# EAGLE design STorM32 RPiHat v060 (EAGLE 7.5.0)
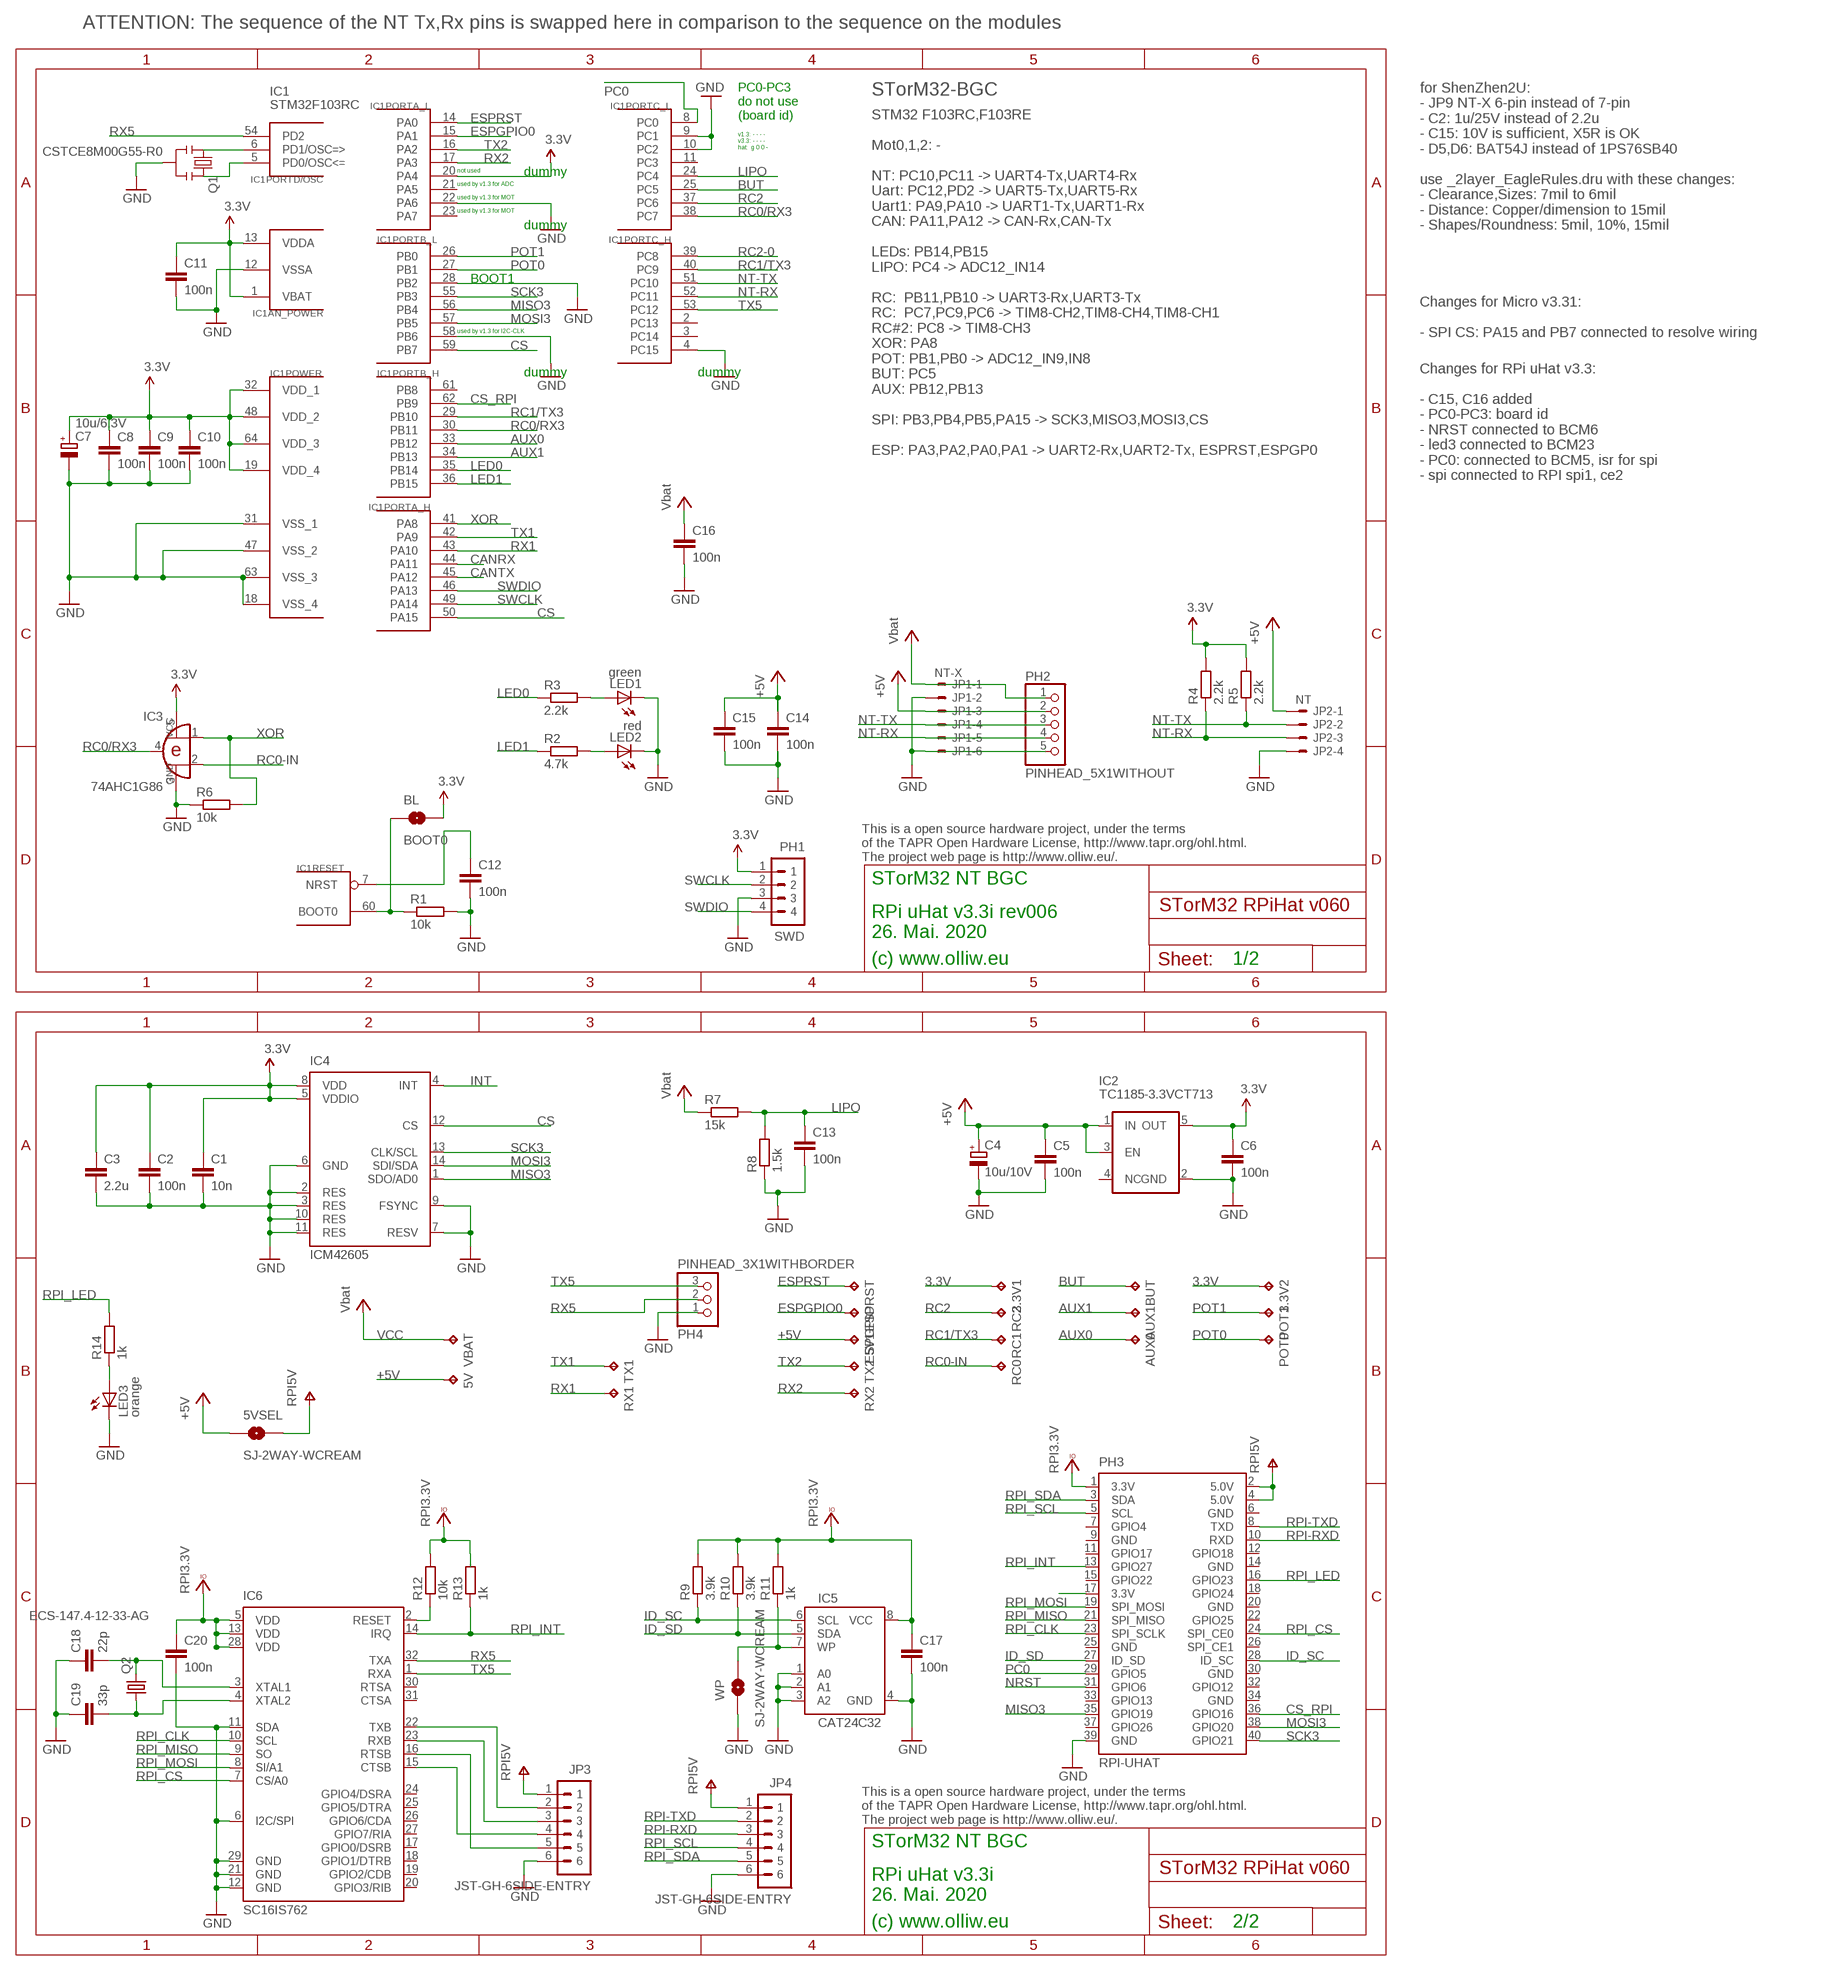
[diagram p0: schematic, sheet 1]

## Parts
3.3V1  TPB1,27  [B1,27]
3.3V2  TPB1,27  [B1,27]
5V  TPB1,27  [B1,27]
5V1  TPB1,27  [B1,27]
5VSEL  SJ-2WAY-WCREAM  [SJ-2WAY-BIG-WCREAM]
AUX0  TPB1,27  [B1,27]
AUX1  TPB1,27  [B1,27]
BL  BOOT0  SOLDERJUMPERNO  [SJ_2S-NO]
BUT  TPB1,27  [B1,27]
C1  10n  C-EUC0402  [C0402]
C2  100n  C-EUC0402  [C0402]
C3  2.2u  C-EUC0603  [C0603]
C4  10u/10V  CPOL-EUSMCA  [SMC_A]
C5  100n  C-EUC0603  [C0603]
C6  100n  C-EUC0402  [C0402]
C7  10u/6.3V  CPOL-EUSMCA  [SMC_A]
C8  100n  C-EUC0402  [C0402]
C9  100n  C-EUC0402  [C0402]
C10  100n  C-EUC0402  [C0402]
C11  100n  C-EUC0402  [C0402]
C12  100n  C-EUC0402  [C0402]
C13  100n  C-EUC0402  [C0402]
C14  100n  C-EUC0402  [C0402]
C15  100n  C-EUC0402  [C0402]
C16  100n  C-EUC0603  [C0603]
C17  100n  C-EUC0402  [C0402]
C18  22p  C-EUC0402  [C0402]
C19  33p  C-EUC0402  [C0402]
C20  100n  C-EUC0402  [C0402]
ESPGPIO  TPB1,27  [B1,27]
ESPRST  TPB1,27  [B1,27]
IC1  STM32F103RCT6  STM32F10XRXT6  [TQFP64]
IC2  TC1185-3.3VCT713  V_REG_TPS76433SOT23-5  [SOT23-5]
IC3  74AHC1G86  [SOT23-5-VER1]
IC4  ICM42605  [LGA14-2.5X3]
IC5  CAT24C32  [TSSOP8-4.3X3]
IC6  SC16IS762  [QFN-32]
JP1  NT-X  SM06B-SRSS-TB  [SM06B-SRSS-TB]
JP2  NT  SM04B-SRSS-TB  [SM04B-SRSS-TB]
JP3  JST-GH-6SIDE-ENTRY  [SM06B-GHS-TB]
JP4  JST-GH-6SIDE-ENTRY  [SM06B-GHS-TB]
LED1  green  LEDCHIPLED_0603  [CHIPLED_0603]
LED2  red  LEDCHIPLED_0603  [CHIPLED_0603]
LED3  orange  LEDCHIPLED_0603  [CHIPLED_0603]
PH1  SWD  P4X1_1P27-OCT_BILEX  [4X1_1P27_OCT_BILEX]
PH2  PINHEAD_5X1WITHOUT  [PINHEAD_5X1_WO]
PH3  RPI-UHAT  [RPI-40W-UHAT]
PH4  PINHEAD_3X1WITHBORDER  [PINHEAD_3X1]
POT0  TPB1,27  [B1,27]
POT1  TPB1,27  [B1,27]
Q1  CSTCE8M00G55-R0  RESONATORSMD  [RESONATOR-SMD]
Q2  ECS-147.4-12-33-AG  QUARZ3.2X2.5  [CRYSTAL-SMD-3P2X2P5]
R1  10k  R-EU_R0402  [R0402]
R2  4.7k  R-EU_R0402  [R0402]
R3  2.2k  R-EU_R0402  [R0402]
R4  2.2k  R-EU_R0402  [R0402]
R5  2.2k  R-EU_R0402  [R0402]
R6  10k  R-EU_R0402  [R0402]
R7  15k  R-EU_R0402  [R0402]
R8  1.5k  R-EU_R0402  [R0402]
R9  3.9k  R-EU_R0402  [R0402]
R10  3.9k  R-EU_R0402  [R0402]
R11  1k  R-EU_R0402  [R0402]
R12  10k  R-EU_R0402  [R0402]
R13  1k  R-EU_R0402  [R0402]
R14  1k  R-EU_R0402  [R0402]
RC0  TPB1,27  [B1,27]
RC1  TPB1,27  [B1,27]
RC2  TPB1,27  [B1,27]
RX1  TPB1,27  [B1,27]
RX2  TPB1,27  [B1,27]
TX1  TPB1,27  [B1,27]
TX2  TPB1,27  [B1,27]
VBAT  TPB1,27  [B1,27]
WP  SJ-2WAY-WCREAM  [SJ-2WAY-BIG-WCREAM]

## Nets
3.3V: 3.3V1.TP 3.3V2.TP BL.2 C1.1 C2.1 C3.1 C6.1 C7.+ C8.1 C9.1 C10.1 C11.1 IC1.1(AN_POWER:VBAT) IC1.13(AN_POWER:VDDA) IC1.19(POWER:VDD_4) IC1.20(PORTA_L:PA4) IC1.32(POWER:VDD_1) IC1.48(POWER:VDD_2) IC1.64(POWER:VDD_3) IC2.5(OUT) IC3.5(VCC) IC4.5(VDDIO) IC4.8(VDD) PH1.1 R4.2 R5.2
+5V: 5V1.TP 5V.TP 5VSEL.1 C4.+ C5.1 C14.1 C15.1 IC2.1(IN) IC2.3(EN) JP1.3 JP2.1 PH2.2
AUX0: AUX0.TP IC1.33(PORTB_H:PB12)
AUX1: AUX1.TP IC1.34(PORTB_H:PB13)
BOOT0: BL.1 IC1.60(RESET:BOOT0) R1.1
BUT: BUT.TP IC1.25(PORTC_L:PC5)
CANRX: IC1.44(PORTA_H:PA11)
CANTX: IC1.45(PORTA_H:PA12)
CS: IC1.50(PORTA_H:PA15) IC1.59(PORTB_L:PB7) IC4.12(CS)
CS_RPI: IC1.62(PORTB_H:PB9) PH3.36(GPIO16)
CTSB: IC6.15(CTSB) JP3.4
ESPGPIO0: ESPGPIO.TP IC1.15(PORTA_L:PA1)
ESPRST: ESPRST.TP IC1.14(PORTA_L:PA0)
GND: C1.2 C2.2 C3.2 C4.- C5.2 C6.2 C7.- C8.2 C9.2 C10.2 C11.2 C12.2 C13.2 C14.2 C15.2 C16.2 C17.2 C18.1 C19.1 C20.2 IC1.4(PORTC_H:PC15) IC1.9(PORTC_L:PC1) IC1.10(PORTC_L:PC2) IC1.12(AN_POWER:VSSA) IC1.18(POWER:VSS_4) IC1.22(PORTA_L:PA6) IC1.28(PORTB_L:PB2) IC1.31(POWER:VSS_1) IC1.47(POWER:VSS_2) IC1.58(PORTB_L:PB6) IC1.63(POWER:VSS_3) IC2.2(GND) IC3.3(GND) IC4.2(RES) IC4.3(RES) IC4.6(GND) IC4.7(RESV) IC4.9(FSYNC) IC4.10(RES) IC4.11(RES) IC5.1(A0) IC5.2(A1) IC5.3(A2) IC5.4(GND) IC6.6(I2C/SPI) IC6.11(SDA) IC6.12(GND) IC6.21(GND) IC6.29(GND) JP1.2 JP1.6 JP2.4 JP3.6 JP4.6 LED1.C LED2.C LED3.C PH1.3 PH2.5 PH3.39(GND) PH4.1 Q1.2 R1.2 R6.1 R8.1 WP.1
ID_SC: IC5.6(SCL) PH3.28(ID_SC) R9.1
ID_SD: IC5.5(SDA) PH3.27(ID_SD) R10.1
INT: IC4.4(INT)
LED0: IC1.35(PORTB_H:PB14) R3.1
LED1: IC1.36(PORTB_H:PB15) R2.1
LIPO: C13.1 IC1.24(PORTC_L:PC4) R7.2 R8.2
MISO3: IC1.56(PORTB_L:PB4) IC4.1(SDO/AD0) PH3.35(GPIO19)
MOSI3: IC1.57(PORTB_L:PB5) IC4.14(SDI/SDA) PH3.38(GPIO20)
N$5: IC6.2(RESET) R12.1
N$6: C18.2 IC6.3(XTAL1) Q2.3
N$7: C19.2 IC6.4(XTAL2) Q2.1
N$8: LED1.A R3.2
N$9: LED2.A R2.2
N$10: LED3.A R14.1
N$11: IC1.5(PORTD/OSC:PD0/OSC<=) Q1.3
N$12: IC1.6(PORTD/OSC:PD1/OSC=>) Q1.1
N$15: PH3.17(3.3V)
N$16: IC5.7(WP) R11.1 WP.2
NRST: C12.1 IC1.7(RESET:NRST) PH3.31(GPIO6)
NT-RX: IC1.52(PORTC_H:PC11) JP1.5 JP2.3 PH2.4 R4.1
NT-TX: IC1.51(PORTC_H:PC10) JP1.4 JP2.2 PH2.3 R5.1
PC0: IC1.8(PORTC_L:PC0) PH3.29(GPIO5)
POT0: IC1.27(PORTB_L:PB1) POT0.TP
POT1: IC1.26(PORTB_L:PB0) POT1.TP
RC0-IN: IC3.2(I1) RC0.TP
RC0/RX3: IC1.30(PORTB_H:PB11) IC1.38(PORTC_L:PC7) IC3.4(O)
RC1/TX3: IC1.29(PORTB_H:PB10) IC1.40(PORTC_H:PC9) RC1.TP
RC2: IC1.37(PORTC_L:PC6) RC2.TP
RC2-0: IC1.39(PORTC_H:PC8)
RPI3.3V: C17.1 C20.1 IC5.8(VCC) IC6.5(VDD) IC6.13(VDD) IC6.28(VDD) PH3.1(3.3V) R9.2 R10.2 R11.2 R12.2 R13.2
RPI5V: 5VSEL.2 JP3.1 JP4.1 PH3.2(5.0V) PH3.4(5.0V)
RPI-RXD: JP4.3 PH3.10(RXD)
RPI-TXD: JP4.2 PH3.8(TXD)
RPI_CLK: IC6.10(SCL) PH3.23(SPI_SCLK)
RPI_CS: IC6.7(CS/A0) PH3.24(SPI_CE0)
RPI_INT: IC6.14(IRQ) PH3.13(GPIO27) R13.1
RPI_LED: PH3.16(GPIO23) R14.2
RPI_MISO: IC6.9(SO) PH3.21(SPI_MISO)
RPI_MOSI: IC6.8(SI/A1) PH3.19(SPI_MOSI)
RPI_SCL: JP4.4 PH3.5(SCL)
RPI_SDA: JP4.5 PH3.3(SDA)
RTSB: IC6.16(RTSB) JP3.5
RX1: IC1.43(PORTA_H:PA10) RX1.TP
RX2: IC1.17(PORTA_L:PA3) RX2.TP
RX5: IC1.54(PORTD/OSC:PD2) IC6.32(TXA) PH4.2
RXB: IC6.23(RXB) JP3.3
SCK3: IC1.55(PORTB_L:PB3) IC4.13(CLK/SCL) PH3.40(GPIO21)
SWCLK: IC1.49(PORTA_H:PA14) PH1.2
SWDIO: IC1.46(PORTA_H:PA13) PH1.4
TX1: IC1.42(PORTA_H:PA9) TX1.TP
TX2: IC1.16(PORTA_L:PA2) TX2.TP
TX5: IC1.53(PORTC_H:PC12) IC6.1(RXA) PH4.3
TXB: IC6.22(TXB) JP3.2
VCC: C16.1 JP1.1 PH2.1 R7.1 VBAT.TP ; supply symbol labelled Vbat
XOR: IC1.41(PORTA_H:PA8) IC3.1(I0) R6.2
Unconnected: IC1.2(PORTC_H:PC13) IC1.3(PORTC_H:PC14) IC1.11(PORTC_L:PC3) IC1.21(PORTA_L:PA5) IC1.23(PORTA_L:PA7) IC1.61(PORTB_H:PB8) IC2.4(NC) IC6.17(GPIO0/DSRB) IC6.18(GPIO1/DTRB) IC6.19(GPIO2/CDB) IC6.20(GPIO3/RIB) IC6.24(GPIO4/DSRA) IC6.25(GPIO5/DTRA) IC6.26(GPIO6/CDA) IC6.27(GPIO7/RIA) IC6.30(RTSA) IC6.31(CTSA) PH3.7(GPIO4) PH3.11(GPIO17) PH3.12(GPIO18) PH3.15(GPIO22) PH3.18(GPIO24) PH3.22(GPIO25) PH3.26(SPI_CE1) PH3.32(GPIO12) PH3.33(GPIO13) PH3.37(GPIO26)

## Notes on the sheet
- ATTENTION: The sequence of the NT Tx,Rx pins is swapped here in comparison to the sequence on the modules
- PC0-PC3
  do not use
  (board id)
- for ShenZhen2U:
  - JP9 NT-X 6-pin instead of 7-pin
  - C2: 1u/25V instead of 2.2u
  - C15: 10V is sufficient, X5R is OK
  - D5,D6: BAT54J instead of 1PS76SB40
  
  use _2layer_EagleRules.dru with these changes:
  - Clearance,Sizes: 7mil to 6mil
  - Distance: Copper/dimension to 15mil
  - Shapes/Roundness: 5mil, 10%, 15mil
- IC1 | STorM32-BGC
- STM32F103RC
- STM32 F103RC,F103RE
  
  Mot0,1,2: -
  
  NT: PC10,PC11 -> UART4-Tx,UART4-Rx
  Uart: PC12,PD2 -> UART5-Tx,UART5-Rx
  Uart1: PA9,PA10 -> UART1-Tx,UART1-Rx
  CAN: PA11,PA12 -> CAN-Rx,CAN-Tx
  
  LEDs: PB14,PB15
  LIPO: PC4 -> ADC12_IN14
  
  RC:  PB11,PB10 -> UART3-Rx,UART3-Tx
  RC:  PC7,PC9,PC6 -> TIM8-CH2,TIM8-CH4,TIM8-CH1
  RC#2: PC8 -> TIM8-CH3
  XOR: PA8
  POT: PB1,PB0 -> ADC12_IN9,IN8
  BUT: PC5
  AUX: PB12,PB13
  
  SPI: PB3,PB4,PB5,PA15 -> SCK3,MISO3,MOSI3,CS
  
  ESP: PA3,PA2,PA0,PA1 -> UART2-Rx,UART2-Tx, ESPRST,ESPGP0
- v1.3: - - - -
  v3.3: - - - -
  hat:  g 0 0 -
- not used
- dummy
- used by v1.3 for ADC
- used by v1.3 for MOT
- used by v1.3 for MOT
- dummy
- BOOT1
- Changes for Micro v3.31:
  
  - SPI CS: PA15 and PB7 connected to resolve wiring
- used by v1.3 for I2C-CLK
- Changes for RPi uHat v3.3:
  
  - C15, C16 added
  - PC0-PC3: board id
  - NRST connected to BCM6
  - led3 connected to BCM23
  - PC0: connected to BCM5, isr for spi
  - spi connected to RPI spi1, ce2
- dummy | dummy
- This is a open source hardware project, under the terms
  of the TAPR Open Hardware License, http://www.tapr.org/ohl.html.
  The project web page is http://www.olliw.eu/.
- STorM32 NT BGC
- RPi uHat v3.3i rev006
  26. Mai. 2020
- (c) www.olliw.eu | 1/2
- This is a open source hardware project, under the terms
  of the TAPR Open Hardware License, http://www.tapr.org/ohl.html.
  The project web page is http://www.olliw.eu/.
- STorM32 NT BGC
- RPi uHat v3.3i
  26. Mai. 2020
- (c) www.olliw.eu | 2/2

## Power pins joined to a net without a drawn wire
GND: PH3.6(GND) PH3.9(GND) PH3.14(GND) PH3.20(GND) PH3.25(GND) PH3.30(GND) PH3.34(GND)

## Library data of the parts
3.3V1 3.3V2 5V 5V1 AUX0 AUX1 BUT ESPGPIO ESPRST POT0 POT1 RC0 RC1 RC2 RX1 RX2 TX1 TX2 VBAT = testpad:TP: Test pad
5VSEL WP = # stdlib:SJ-2WAY
BL = # SparkFun2:SOLDERJUMPER: Solder Jumper Standard SMD solder jumper. Used to automate production. Two varients : Normally Open and Normally Closed are the same, but have different paste layers. NC will have a large amount of paste and should jumper during reflow.
C1-C3 C5 C6 C8-C20 = rcl:C-EU: CAPACITOR, European symbol
C4 C7 = rcl:CPOL-EU: POLARIZED CAPACITOR, European symbol
IC1 = # stm32:STM32F10XRXT6: STM32F101/103 64pin LQFP
IC2 = # SparkFun2:V_REG_TPS76433: Voltage Regulator Older TI part. LDO 150mA regulator. No output by-pass cap option. See V_REG_LDO for a better part.
IC3 = # stdlib:74AHC1G86
IC4 = # stdlib:ICM42605
IC5 = # stdlib:CAT24C32
IC6 = # stdlib:SC16IS762
JP1 = con-jst2:?M06B-SRSS-TB: Disconnectable Crimp style connector, 1.0mm pitch 6 contacts
JP2 = con-jst2:?M04B-SRSS-TB: Disconnectable Crimp style connector, 1.0mm pitch 4 contacts
JP3 JP4 = # stdlib:JST-GH-6
LED1-LED3 = led:LED: LED OSRAM: - CHIPLED LG R971, LG N971, LY N971, LG Q971, LY Q971, LO R971, LY R971 LH N974, LH R974 LS Q976, LO Q976, LY Q976 LO Q996 - Hyper CHIPLED LW Q18S LB Q993, LB Q99A, LB R99A - SideLED LS A670, LO A670, LY A670, LG A670, LP A670 LB A673, LV A673, LT A673, LW A673 LH A674 LY A675 LS A676, LA A676, LO A676, LY A676, LW A676 LS A679, LY A679, LG A679 - Hyper Micro SIDELED® LS Y876, LA Y876, LO Y876, LY Y876 LT Y87S - SmartLED LW L88C, LW L88S LB L89C, LB L89S, LG L890 LS L89K, LO L89K, LY L89K LS L896, LA L896, LO L896, LY L896 - TOPLED LS T670, LO T670, LY T670, LG T670, LP T670 LSG T670, LSP T670, LSY T670, LOP T670, LYG T670 LG T671, LOG T671, LSG T671 LB T673, LV T673, LT T673, LW T673 LH T674 LS T676, LA T676, LO T676, LY T676, LB T676, LH T676, LSB T676, LW T676 LB T67C, LV T67C, LT T67C, LS T67K, LO T67K, LY T67K, LW E67C LS E67B, LA E67B, LO E67B, LY E67B, LB E67C, LV E67C, LT E67C LW T67C LS T679, LY T679, LG T679 LS T770, LO T770, LY T770, LG T770, LP T770 LB T773, LV T773, LT T773, LW T773 LH T774 LS E675, LA E675, LY E675, LS T675 LS T776, LA T776, LO T776, LY T776, LB T776 LHGB T686 LT T68C, LB T68C - Hyper Mini TOPLED® LB M676 - Mini TOPLED Santana® LG M470 LS M47K, LO M47K, LY M47K Source: http://www.osram.convergy.de LUXEON: - LUMILED® LXK2-PW12-R00, LXK2-PW12-S00, LXK2-PW14-U00, LXK2-PW14-V00 LXK2-PM12-R00, LXK2-PM12-S00, LXK2-PM14-U00 LXK2-PE12-Q00, LXK2-PE12-R00, LXK2-PE12-S00, LXK2-PE14-T00, LXK2-PE14-U00 LXK2-PB12-K00, LXK2-PB12-L00, LXK2-PB12-M00, LXK2-PB14-N00, LXK2-PB14-P00, LXK2-PB14-Q00 LXK2-PR12-L00, LXK2-PR12-M00, LXK2-PR14-Q00, LXK2-PR14-R00 LXK2-PD12-Q00, LXK2-PD12-R00, LXK2-PD12-S00 LXK2-PH12-R00, LXK2-PH12-S00 LXK2-PL12-P00, LXK2-PL12-Q00, LXK2-PL12-R00 Source: www.luxeon.com KINGBRIGHT: KA-3528ASYC Source: www.kingbright.com
PH1 = # stdlib:P4X1_1P27
PH2 = # stdlib:PINHEAD_5X1
PH3 = # stdlib:RPI-UHAT
PH4 = # stdlib:PINHEAD_3X1
Q1 = # SparkFun2:RESONATOR: Resonator Small SMD resonator. This is the itty bitty 10/20MHz resonators with built in caps. CSTCE10M0G55 and CSTCE20M0V53. Footprint has been reviewed closely but hasn't been tested yet.
Q2 = # stdlib:QUARZ
R1-R14 = rcl:R-EU_: RESISTOR, European symbol

## Board
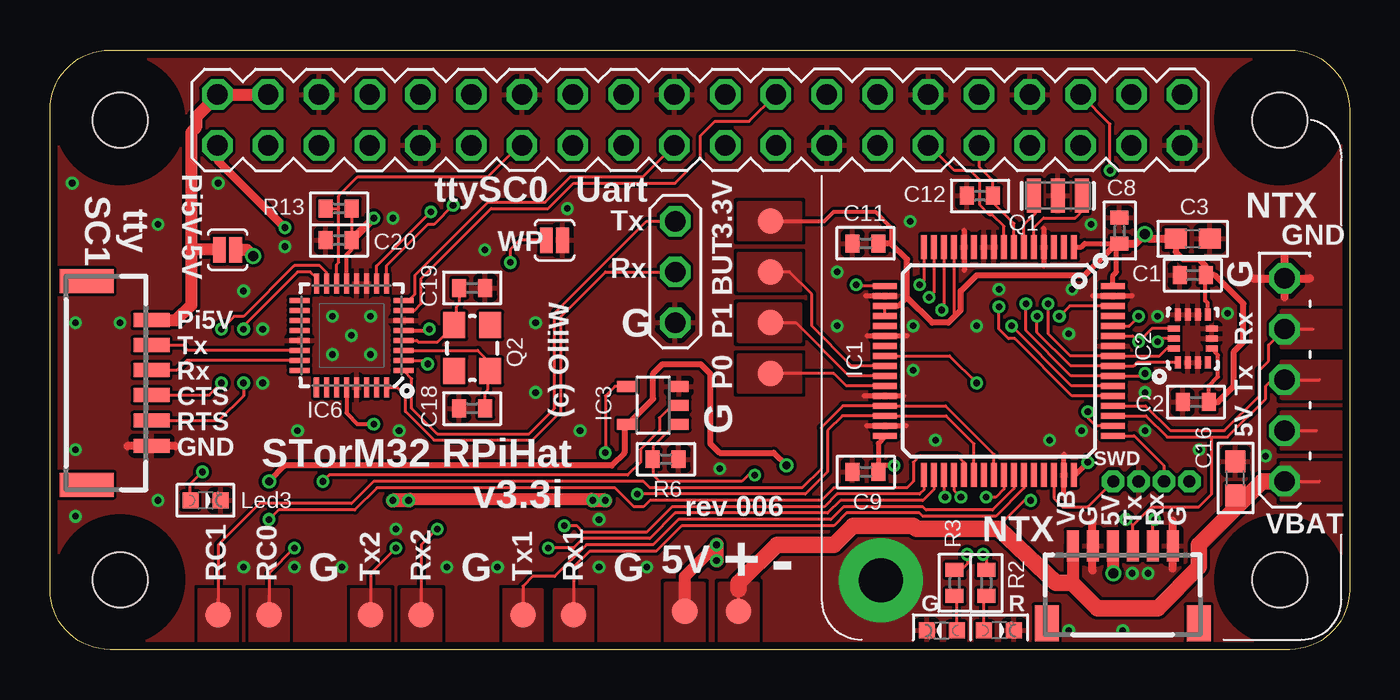
[diagram p1: board, top side]
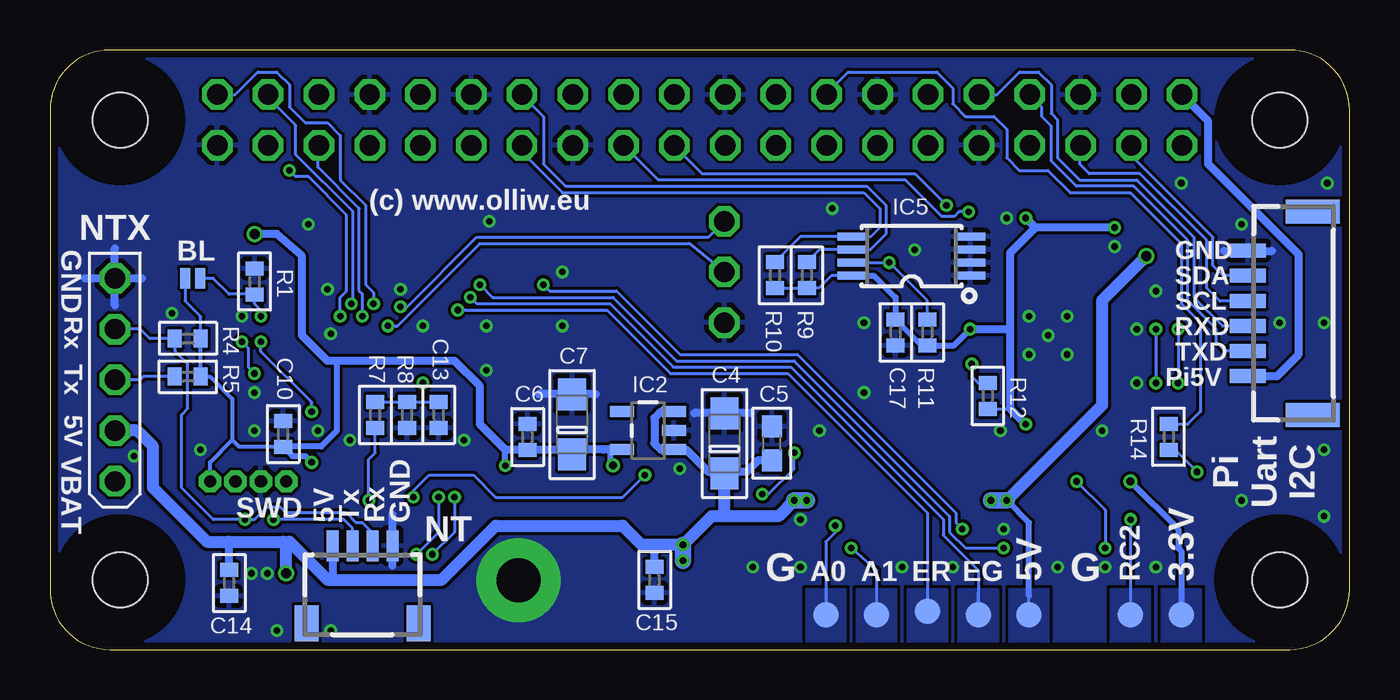
[diagram p2: board, bottom side, seen from below]

Size 65 x 30 mm. Coordinates in mm from the lower left corner, seen from the top.
Copper layers (1*16): Top 0.035mm / dielectric 1.5mm / Bottom 0.035mm
Design rules "ShenZhen2U_2layer_EagleRules *": minimum track width 6mil, minimum drill 12mil, track to track 6mil, track to pad 6mil, pad to pad 6mil, via to via 6mil, smd to smd 0mil, copper to edge 15mil, drill to drill 10mil, minimum pad ring 10mil, minimum via ring 6mil, stop-mask expansion 2mil, vias tented up to drill 25mil, thermal gap 10mil

### Footprints (pad centres in the part's own frame; a part is rotated, then mirrored left to right if it is on the bottom)
B1,27 = smd 1.27 x 1.27: TP 0,0
SJ-2WAY-BIG-WCREAM = smd 0.635 x 1.27: 1 -0.4,0; 2 0.413,0
SJ_2S-NO = smd 0.508 x 1.016: 1 -0.381,0; 2 0.381,0
C0402 = smd 0.7 x 0.9: 1 -0.65,0; 2 0.65,0
C0603 = smd 1.1 x 1: 1 -0.85,0; 2 0.85,0
SMC_A = smd 1.6 x 1.4: + -1.5,0; - 1.5,0
TQFP64 = smd 1.2 x 0.3: 1 -5.7,3.75; 2 -5.7,3.25; 3 -5.7,2.75; 4 -5.7,2.25; 5 -5.7,1.75; 6 -5.7,1.25; 7 -5.7,0.75; 8 -5.7,0.25; 9 -5.7,-0.25; 10 -5.7,-0.75; 11 -5.7,-1.25; 12 -5.7,-1.75; 13 -5.7,-2.25; 14 -5.7,-2.75; 15 -5.7,-3.25; 16 -5.7,-3.75; 33 5.7,-3.75; 34 5.7,-3.25; 35 5.7,-2.75; 36 5.7,-2.25; 37 5.7,-1.75; 38 5.7,-1.25; 39 5.7,-0.75; 40 5.7,-0.25; 41 5.7,0.25; 42 5.7,0.75; 43 5.7,1.25; 44 5.7,1.75; 45 5.7,2.25; 46 5.7,2.75; 47 5.7,3.25; 48 5.7,3.75 | smd 0.3 x 1.2: 17 -3.75,-5.7; 18 -3.25,-5.7; 19 -2.75,-5.7; 20 -2.25,-5.7; 21 -1.75,-5.7; 22 -1.25,-5.7; 23 -0.75,-5.7; 24 -0.25,-5.7; 25 0.25,-5.7; 26 0.75,-5.7; 27 1.25,-5.7; 28 1.75,-5.7; 29 2.25,-5.7; 30 2.75,-5.7; 31 3.25,-5.7; 32 3.75,-5.7; 49 3.75,5.7; 50 3.25,5.7; 51 2.75,5.7; 52 2.25,5.7; 53 1.75,5.7; 54 1.25,5.7; 55 0.75,5.7; 56 0.25,5.7; 57 -0.25,5.7; 58 -0.75,5.7; 59 -1.25,5.7; 60 -1.75,5.7; 61 -2.25,5.7; 62 -2.75,5.7; 63 -3.25,5.7; 64 -3.75,5.7
SOT23-5 = smd 0.55 x 1.2: 1 -0.95,-1.3; 2 0,-1.3; 3 0.95,-1.3; 4 0.95,1.3; 5 -0.95,1.3
SOT23-5-VER1 = smd 0.55 x 0.99: 1 -0.95,-1.29; 2 0,-1.29; 3 0.95,-1.29; 4 0.95,1.3; 5 -0.95,1.3
LGA14-2.5X3 = smd 0.6 x 0.3: 1 -1.2,0.75; 2 -1.2,0.25; 3 -1.2,-0.25; 4 -1.2,-0.75; 8 1.2,-0.75; 9 1.2,-0.25; 10 1.2,0.25; 11 1.2,0.75 | smd 0.3 x 0.6: 5 -0.5,-0.95; 6 0,-0.95; 7 0.5,-0.95; 12 0.5,0.95; 13 0,0.95; 14 -0.5,0.95
TSSOP8-4.3X3 = smd 1.5 x 0.4: 1 -2.95,0.975; 2 -2.95,0.325; 3 -2.95,-0.325; 4 -2.95,-0.975; 5 2.95,-0.975; 6 2.95,-0.325; 7 2.95,0.325; 8 2.95,0.975
QFN-32 = smd 1 x 0.25: 1 -2.6,1.75; 2 -2.6,1.25; 3 -2.6,0.75; 4 -2.6,0.25; 5 -2.6,-0.25; 6 -2.6,-0.75; 7 -2.6,-1.25; 8 -2.6,-1.75; 17 2.6,-1.75; 18 2.6,-1.25; 19 2.6,-0.75; 20 2.6,-0.25; 21 2.6,0.25; 22 2.6,0.75; 23 2.6,1.25; 24 2.6,1.75 | smd 0.25 x 1: 9 -1.75,-2.6; 10 -1.25,-2.6; 11 -0.75,-2.6; 12 -0.25,-2.6; 13 0.25,-2.6; 14 0.75,-2.6; 15 1.25,-2.6; 16 1.75,-2.6; 26 1.25,2.6; 27 0.75,2.6; 28 0.25,2.6; 29 -0.25,2.6; 30 -0.75,2.6; 31 -1.25,2.6; 32 -1.75,2.6 | smd 0.27 x 1: 25 1.75,2.6
SM06B-SRSS-TB = smd 0.6 x 1.55: 1 -2.5,2.975; 2 -1.5,2.975; 3 -0.5,2.975; 4 0.5,2.975; 5 1.5,2.975; 6 2.5,2.975 | smd 1.2 x 1.8: FIT@1 -3.8,-0.9; FIT@2 3.8,-0.9
SM04B-SRSS-TB = smd 0.6 x 1.55: 1 -1.5,2.975; 2 -0.5,2.975; 3 0.5,2.975; 4 1.5,2.975 | smd 1.2 x 1.8: FIT@1 -2.8,-0.9; FIT@2 2.8,-0.9
SM06B-GHS-TB = smd 0.7 x 1.8: 1 -3.145,4.6; 2 -1.895,4.6; 3 -0.645,4.6; 4 0.605,4.6; 5 1.875,4.6; 6 3.145,4.6 | smd 1.2 x 2.7: FIT@1 -5.095,1.35; FIT@2 5.095,1.35
CHIPLED_0603 = smd 0.8 x 0.8: A 0,-0.75; C 0,0.75
4X1_1P27_OCT_BILEX = drill 0.61 pad 1.118 octagon: 1 0,0; 2 0,-1.27; 3 0,-2.54; 4 0,-3.81
PINHEAD_5X1_WO = drill 1.016 octagon: 1 0,0; 2 0,-2.54; 3 0,-5.08; 4 0,-7.62; 5 0,-10.16
RPI-40W-UHAT = drill 1.016 octagon: 1 8.37,25.23; 2 8.37,27.77; 3 10.91,25.23; 4 10.91,27.77; 5 13.45,25.23; 6 13.45,27.77; 7 15.99,25.23; 8 15.99,27.77; 9 18.53,25.23; 10 18.53,27.77; 11 21.07,25.23; 12 21.07,27.77; 13 23.61,25.23; 14 23.61,27.77; 15 26.15,25.23; 16 26.15,27.77; 17 28.69,25.23; 18 28.69,27.77; 19 31.23,25.23; 20 31.23,27.77; 21 33.77,25.23; 22 33.77,27.77; 23 36.31,25.23; 24 36.31,27.77; 25 38.85,25.23; 26 38.85,27.77; 27 41.39,25.23; 28 41.39,27.77; 29 43.93,25.23; 30 43.93,27.77; 31 46.47,25.23; 32 46.47,27.77; 33 49.01,25.23; 34 49.01,27.77; 35 51.55,25.23; 36 51.55,27.77; 37 54.09,25.23; 38 54.09,27.77; 39 56.63,25.23; 40 56.63,27.77 | hole 2.75: 3.5,26.5; 61.5,26.5; 61.5,3.5; 3.5,3.5
PINHEAD_3X1 = drill 1.016 octagon: 1 0,0; 2 0,-2.54; 3 0,-5.08
RESONATOR-SMD = smd 0.7 x 1.7: 1 -1.2,0; 2 0,0; 3 1.2,0
CRYSTAL-SMD-3P2X2P5 = smd 1.3 x 1.1: 1 -1.15,-0.9; 2 1.15,-0.9; 3 1.15,0.9; 4 -1.15,0.9
R0402 = smd 0.7 x 0.9: 1 -0.65,0; 2 0.65,0

### Placement (x,y rotation side)
3.3V1  36.04,21.43 0 top
3.3V2  8.41,1.75 0 bottom
5V  31.75,1.91 0 top
5V1  16.03,1.75 0 bottom
5VSEL  8.89,20 180 top
AUX0  26.19,1.75 0 bottom
AUX1  23.65,1.75 0 bottom
BL  57.86,18.57 180 bottom
BUT  36.04,18.89 0 top
C1  57.15,18.73 180 top
C2  57.31,12.38 180 top
C3  57.15,20.56 0 top
C4  31.27,10.32 90 bottom
C5  28.89,10.32 90 bottom
C6  41.12,10.64 90 bottom
C7  38.89,11.27 90 bottom
C8  53.5,20.95 90 top
C9  40.8,8.89 180 top
C10  53.34,10.79 90 bottom
C11  40.8,20.32 180 top
C12  46.51,22.7 180 top
C13  45.56,11.75 270 bottom
C14  56.04,3.33 270 bottom
C15  34.77,3.49 270 bottom
C16  59.29,8.57 90 top
C17  22.7,15.88 270 bottom
C18  21.11,12.06 0 top
C19  21.11,18.1 180 top
C20  14.45,20.48 180 top
ESPGPIO  18.57,1.75 0 bottom
ESPRST  21.11,1.91 0 bottom
IC1  47.47,14.45 270 top
IC2  35.08,10.95 90 bottom
IC3  30.16,12.22 90 top
IC4  57.15,15.56 90 top
IC5  21.91,19.68 180 bottom
IC6  15.08,15.72 180 top
JP1  53.66,2.22 0 top
JP2  49.37,2.22 0 bottom
JP3  0.48,13.34 270 top
JP4  0.48,16.83 90 bottom
LED1  44.61,0.95 90 top
LED2  47.47,0.95 270 top
LED3  7.78,7.46 270 top
PH1  56.99,8.41 270 top
PH2  61.75,8.41 180 top
PH3  0,0 0 top
PH4  31.27,16.35 180 top
POT0  36.04,13.81 0 top
POT1  36.04,16.35 0 top
Q1  50.4,22.7 0 top
Q2  21.11,15.08 270 top
R1  54.77,18.41 90 bottom
R2  46.83,3.33 270 top
R3  45.24,3.33 270 top
R4  58.1,15.56 0 bottom
R5  58.1,13.65 0 bottom
R6  30.8,9.53 180 top
R7  48.74,11.75 90 bottom
R8  47.15,11.75 90 bottom
R9  27.15,18.73 270 bottom
R10  28.73,18.73 270 bottom
R11  21.11,15.88 270 bottom
R12  18.1,12.7 270 bottom
R13  14.45,22.07 0 top
R14  9.05,10.64 90 bottom
RC0  10.95,1.75 0 top
RC1  8.41,1.75 0 top
RC2  10.95,1.75 0 bottom
RX1  26.19,1.75 0 top
RX2  18.57,1.75 0 top
TX1  23.65,1.75 0 top
TX2  16.03,1.75 0 top
VBAT  34.45,1.91 0 top
WP  25.24,20.48 180 top

### Tracks (layer width: path | path; a pad name or v marks a point on that pad's centre or on a via)
3.3V  (via drill 0.33, 0.4, 0.5)
  Top 0.152: 57.78,18.56 C1.1 | IC1.20 IC1.19 | 56.14,20.56 C3.1 | IC1.13 45.22,16.86 45.32,16.75 | IC1.48 51.29,8.75 | IC1.32 41.77,10.65 | 41.61,9.21 C9.1 41.43,9.06
  Top 0.203: IC4.8 57.9,17.35 57.78,17.46 57.78,18.56 | C2.1 57.96,13.19 58.42,13.65 58.42,14.74 IC4.5 | 3.3V1.TP 38.73,21.43 39.21,21.91 41.27,21.91 42.07,21.11 42.07,20.32
  Top 0.254: IC1.19 42.44,17.2 42.86,17.62 | 51.29,8.75 v51.91,9.37 | 41.77,10.65 41.43,10.32 41.43,9.06 | v42.23,9.21 41.61,9.21 | IC1.1 51.58,20.15 51.75,20.32 53.17,20.32 | IC1.64 53.17,18.72 53.34,18.89 53.34,20.15
  Top 0.305: C3.1 56.3,19.9 56.67,19.53 57.47,19.53 57.8,19.19 C1.1 58.26,18.73 59.69,17.3 59.69,15.4 59.21,14.92 59.21,13.18 58.42,12.38 C2.1 | C11.1 42.07,20.32 42.86,19.53 42.86,17.62 44.13,16.35 44.93,16.35 45.32,16.75 45.56,16.99 45.56,17.94 46.35,18.73 51.75,18.73 53.17,20.15 C8.1 | v10.95,8.41 11.75,9.21 28.1,9.21 28.73,9.84 28.73,11.27 28.74,11.27 IC3.5 | v36.83,9.21 36.2,9.84 33.5,9.84 33.02,10.32 33.02,13.81 32.54,14.29 30.64,14.29 30.16,13.81 30.16,12.54 28.89,11.27 IC3.5 | IC3.5 29.05,11.27 | 53.17,20.32 C8.1 | 53.34,20.15 C8.1
  Top 0.406: 56.14,20.56 55.01,20.56 v54.77,20.8 54.28,20.3 C8.1
  Bottom 0.152: 3.3V2.TP 8.41,2.86 | 53.2,10.16 C10.1 | IC2.5 36.99,10 | BL.2 58.24,17.45 57.45,16.65 R4.2
  Bottom 0.203: R4.2 R5.2 56.99,13.65 55.88,12.54 55.88,10.48 | PH1.1 56.99,9.37 55.88,10.48 | 53.2,10.16 55.56,10.16 55.88,10.48
  Bottom 0.305: 50.64,14.45 50.64,10.95 51.44,10.16 53.17,10.16 C10.1 53.18,10 52.86,9.68 52.23,9.68 v51.91,9.37 | v42.23,9.21 42.23,9.99 | v10.95,8.41 8.57,6.03 8.57,5.08 8.41,4.92 3.3V2.TP | v36.83,9.21 36.99,9.37 36.99,10
  Bottom 0.406: IC2.5 37.3,10 38.42,10 38.82,10 | 38.82,10 C7.+ | 38.82,10 40.8,10 40.94,9.99 C6.1 42.21,9.99 | 42.23,9.99 42.21,9.99 | 42.21,9.99 43.5,11.27 43.5,13.18 44.77,14.45 50.64,14.45 51.12,14.45 52.39,15.72 52.39,19.68 53.66,20.8 v54.77,20.8
  pour Bottom (isolate 0.305, no thermals): 9.37,0.16 9.37,3.02 7.46,3.02 7.46,0.16
  pour Top (isolate 0.305, no thermals): 34.45,22.38 37.54,22.38 37.54,20.48 34.45,20.48
+5V  (via drill 0.33, 0.5)
  Top 0.152: PH2.2 63.34,10.95 | 53.16,3.83 v53.18,3.81
  Top 0.61: 5V.TP 31.75,3.65 v33.34,5.24 | JP1.3 53.16,3.83 | 5VSEL.1 9.84,20 v10.16,19.68 | v27.15,7.46 27.07,7.54 18.02,7.54 v17.94,7.46
  Top 0.711: v33.34,5.24 v33.34,4.45 | v27.78,7.46 v27.15,7.46 | v17.94,7.46 v17.14,7.46
  Bottom 0.152: 5V1.TP 16.03,2.7 | 53.18,5.24 53.34,5.4 | 31.27,6.83 31.11,6.67
  Bottom 0.305: 16.03,2.7 16.03,6.35 v17.14,7.46
  Bottom 0.406: IC2.3 34.45,11.9 34.77,11.59 34.77,10.32 34.45,10 33.95,10 IC2.1 33.18,10 32.07,8.89 31.34,8.89 | C5.1 29.58,9.47 30.16,8.89 31.34,8.89 | 31.34,8.89 C4.+ | JP2.1 50.87,3.4 51.12,3.49 | C15.1 34.77,5.24 | C14.1 56.04,5.4
  Bottom 0.61: 31.27,6.83 C4.+ | PH2.2 60.64,10.95 59.85,10.16 59.85,8.1 57.15,5.4 56.04,5.4 53.34,5.4 53.02,5.4 51.12,3.49 45.4,3.49 42.7,6.19 36.35,6.19 35.4,5.24 34.77,5.24 v33.34,5.24 31.91,6.67 31.11,6.67 28.57,6.67 v27.78,7.46 | v53.18,3.81 53.18,5.24 | v10.16,19.68 12.38,17.46 12.38,12.22 v17.14,7.46
  Bottom 0.813: v33.34,5.24 v33.34,4.45 | v27.15,7.46 v27.78,7.46 | v17.14,7.46 v17.94,7.46
  pour Top (isolate 0.305, no thermals): 30.8,0.16 30.8,3.33 32.7,3.33 32.7,0.16
  pour Bottom (isolate 0.305, no thermals): 16.99,0.16 16.99,3.02 15.08,3.02 15.08,0.16
  pour Top (isolate 0.305, no thermals): 61.59,11.91 64.61,11.91 64.61,10 61.59,10
AUX0  (via drill 0.33)
  Top 0.152: IC1.33 43.72,8 43.5,7.78 39.37,7.78 38.73,7.14 31.11,7.14 29.84,5.87 26.67,5.87 26.35,6.19 v25.72,6.19
  Bottom 0.152: v25.72,6.19 25.72,5.87 26.19,5.4 AUX0.TP
  pour Bottom (isolate 0.305, no thermals): 27.15,0.16 27.15,3.02 25.24,3.02 25.24,0.16
AUX1  (via drill 0.33)
  Top 0.152: IC1.34 44.22,8.02 43.66,7.46 39.53,7.46 38.89,6.83 31.27,6.83 30,5.56 26.67,5.56 26.19,5.08 v24.92,5.08
  Bottom 0.152: v24.92,5.08 23.65,3.97 AUX1.TP
  pour Bottom (isolate 0.305, no thermals): 24.61,0.16 24.61,3.02 22.7,3.02 22.7,0.16
BOOT0  (via drill 0.33)
  Top 0.152: IC1.60 53.98,16.2 v54.45,16.67
  Bottom 0.152: v54.45,16.67 54.45,16.99 54.75,17.29 R1.1 54.94,17.78 56.04,17.78 56.83,18.57 BL.1
BUT
  Top 0.152: IC1.25 40.1,14.2 38.1,16.19 38.1,17.78 36.99,18.89 BUT.TP
  pour Top (isolate 0.305, no thermals): 34.45,19.84 37.54,19.84 37.54,17.94 34.45,17.94
CS  (via drill 0.33)
  Top 0.152: IC4.12 55.11,16.06 v54.45,15.4 54.15,15.7 IC1.59 | IC1.50 52.3,11.2 51.91,11.59 v51.91,11.91
  Bottom 0.152: v51.91,11.91 51.91,12.38 54.45,14.92 v54.45,15.4
CS_RPI  (via drill 0.33)
  Top 0.152: IC1.62 51.01,17.2 v50.48,16.67 | v53.02,23.97 53.02,26.3 PH3.36
  Bottom 0.152: v50.48,16.67 50.48,17.62 50.16,17.94 50.16,21.75 52.07,23.65 52.7,23.65 v53.02,23.97
CTSB  (via drill 0.33)
  Top 0.152: IC6.15 13.83,18.87 13.49,19.21 12.22,19.21 9.68,16.67 9.21,16.67 v8.57,16.03 | JP3.4 7.97,12.73 v8.57,13.34
  Bottom 0.152: v8.57,16.03 v8.57,13.34
ESPGPIO0  (via drill 0.33)
  Top 0.152: IC1.15 44.22,17.86 v43.97,17.62
  Bottom 0.152: 18.57,2.86 ESPGPIO.TP 18.57,3.97 20.32,5.71 20.32,6.51 27.94,14.13 33.81,14.13 36.99,17.3 43.66,17.3 v43.97,17.62
  pour Bottom (isolate 0.305, no thermals): 19.53,0.16 19.53,3.02 17.62,3.02 17.62,0.16
ESPRST  (via drill 0.33)
  Top 0.152: IC1.14 44.72,17.09 v44.61,16.99
  Bottom 0.152: v44.61,16.99 37.15,16.99 33.97,13.81 28.1,13.81 21.11,6.83 ESPRST.TP
  pour Bottom (isolate 0.305, no thermals): 22.07,0.16 22.07,3.02 20.16,3.02 20.16,0.16
GND  (via drill 0.33, 2.2 pad 4.2)
  Top 0.152: IC1.4 49.72,20.01 49.71,19.21
  Top 0.254: 52.15,17.7 54.13,17.7 | 50.71,7.78 50.71,9.76 | 42.7,12.7 40.72,12.7 | 42.87,15.69 40.88,15.69 | 41.96,17.69 40.8,17.69 | 45.73,20.97 45.73,18.99 | 49.71,21.07 49.71,19.21 | 42.82,11.19 40.84,11.19
  Top 0.406: 60.17,18.57 63.02,18.57 | 61.75,17.62 61.75,19.68 | 56.16,4.05 56.16,6.45 | 52.15,3.95 52.15,6.35 | 6.27,10.18 3.87,10.18
  Bottom 0.406: 60.4,18.57 63.26,18.57 | 61.75,17.22 61.75,20.08 | 47.86,4.21 47.86,6.75 | 29.92,11.83 32.78,11.83 | 37.7,12.78 40.56,12.78 | 6.27,19.94 3.87,19.94
  other vias: 41.55,3.45 22.38,4.13 14.61,4.13 19.84,4.13 27.46,4.13 14.13,16.67 14.13,14.76 16.03,14.76 16.03,16.67 15.08,15.72 44.29,10.48 9.68,4.13 1.11,23.34 46.35,16.19 51.12,18.02 51.59,10.95 50.01,10.48 43.18,13.97 43.18,16.19 39.37,16.19 39.37,18.89 43.02,21.43 54.77,12.86 57.47,10 55.4,16.67 5.4,7.46 24.29,12.86 26.51,10.95 33.5,9.05 53.66,0.95 50.96,0.95 54.13,3.81 60.8,9.68 21.75,20 25.88,22.07 11.75,20.16 17.14,21.59 29.84,4.13 17.46,10.95 12.38,10.95 17.3,6.03 24.29,16.35 52.07,21.27 58.9,16.83 1.27,16.35 5.4,21.27 8.41,23.34 10.64,16.03 9.68,17.94 1.27,10 12.22,4.13 54.93,3.81 3.49,16.35 10.64,13.34 1.27,6.67 47.47,18.02 54.77,10.95 50.96,15.8 27.46,6.51
  pour Top (isolate 0.152, rank 6): 0,0 0,30 65,30 65,0
  pour Bottom (isolate 0.152, rank 6): 0,0 0,30 65,30 65,0
ID_SC
  Bottom 0.152: PH3.28 41.39,27.74 40.32,26.67 40.32,24.29 39.21,23.18 24.13,23.18 23.18,22.23 23.18,20.8 23.96,20.01 IC5.6 26.52,20.01 R9.1
ID_SD
  Bottom 0.152: PH3.27 41.42,25.23 41.42,24.91 39.37,22.86 24.29,22.86 23.5,22.07 23.5,21.11 23.95,20.66 IC5.5 27.46,20.66 R10.1
LED0  (via drill 0.33)
  Top 0.152: IC1.35 44.72,7.67 v44.77,7.62 | v45.88,4.76 45.88,4.29 45.56,3.97 45.1,3.97 R3.1
  Bottom 0.152: v44.77,7.62 44.77,5.87 v45.88,4.76
LED1  (via drill 0.33)
  Top 0.152: IC1.36 45.22,7.96 v45.56,7.62 | v46.67,4.76 46.83,4.6 R2.1
  Bottom 0.152: v45.56,7.62 45.56,5.87 v46.67,4.76
LIPO  (via drill 0.33)
  Top 0.152: IC1.24 44.99,14.7 v46.35,13.34
  Bottom 0.152: v46.35,13.34 46.35,12.38 | 46.35,12.38 45.58,12.38 C13.1 | R7.2 R8.2 46.37,12.4 46.35,12.38
MISO3  (via drill 0.33)
  Top 0.152: IC4.1 54.36,14.36 54.2,14.2 IC1.56 51.05,14.2 49.37,15.88 v49.37,16.67
  Bottom 0.152: v49.37,16.67 49.37,17.78 49.53,17.94 49.53,22.07 51.59,24.13 51.59,25.19 PH3.35
MOSI3  (via drill 0.33)
  Top 0.152: IC4.14 55.86,15.06 55.49,14.7 IC1.57 51.03,14.7 49.93,15.8 v49.93,17.3
  Bottom 0.152: v49.93,17.3 49.85,17.38 49.85,21.91 52.7,24.77 52.7,26.23 54.09,27.61 PH3.38
N$5  (via drill 0.33)
  Top 0.152: IC6.2 18.71,14.47 v18.89,14.29
  Bottom 0.152: v18.89,14.29 18.89,13.65 18.57,13.34 17.95,13.34 R12.1
N$6
  Top 0.152: C18.2 21.76,12.87 21.91,13.02 21.91,13.88 Q2.3 21.91,14.2 21.91,14.45 21.39,14.97 IC6.3
N$7
  Top 0.152: C19.2 20.46,17.29 20.32,17.14 20.32,16.5 Q2.1 19.38,15.4 18.41,15.4 18.35,15.47 IC6.4
N$8
  Top 0.152: LED1.A 45.36,2.57 R3.2
N$9
  Top 0.152: LED2.A 46.72,2.57 R2.2
N$10  (via drill 0.33)
  Top 0.152: v7.62,8.89 6.99,8.26 6.99,7.42 LED3.A
  Bottom 0.152: v7.62,8.89 8.89,10.16 R14.1
N$11
  Top 0.152: IC1.5 49.22,21.12 49.69,21.59 51.28,21.59 51.76,22.08 Q1.3
N$12
  Top 0.152: IC1.6 48.72,21.25 49.21,21.75 49.52,22.08 Q1.1
N$16  (via drill 0.33)
  Top 0.152: WP.2 23.5,20.48 23.02,20 v23.02,19.37
  Bottom 0.152: IC5.7 v23.01,19.36 | R11.1 21.11,17.46 v23.01,19.36 | v23.01,19.36 v23.02,19.37
NRST
  Top 0.152: IC1.7 48.22,21.32 47.24,22.29 C12.1 47.15,22.72 47.15,23.5 46.47,24.17 PH3.31
NT-RX  (via drill 0.33)
  Top 0.152: 63.18,16.03 PH2.4 60.96,15.24 60.96,14.45 60.48,13.97 60.48,12.7 58.74,10.95 56.04,10.95 54.8,12.2 IC1.52 | JP1.5 55.16,6.42 v55.24,6.51
  Bottom 0.152: PH2.4 60.48,16.03 60.01,15.56 R4.1 58.74,15.86 58.74,14.92 58.1,14.29 58.1,12.06 58.42,11.75 58.42,8.1 56.83,6.51 v55.24,6.51 54.77,6.51 54.13,7.14 53.5,7.14 53.18,6.83 50.16,6.83 49.69,6.35 49.37,6.35 48.87,5.85 JP2.3
  pour Top (isolate 0.305, no thermals): 61.59,16.99 64.61,16.99 64.61,15.08 61.59,15.08
NT-TX  (via drill 0.33)
  Top 0.152: 63.5,13.49 PH2.3 61.12,13.49 60.8,13.18 60.8,12.54 58.9,10.64 58.1,10.64 | IC1.51 54.82,11.7 55.88,10.64 58.1,10.64 | 58.1,10.64 58.1,7.78 57.47,7.14 55.09,7.14 54.16,6.21 | JP1.4 54.16,6.21 | v53.82,6.51 53.86,6.51 54.16,6.21
  Bottom 0.152: R5.1 60.33,13.65 60.48,13.49 PH2.3 | JP2.2 49.87,6.06 50.32,6.51 v53.82,6.51
  pour Top (isolate 0.305, no thermals): 61.59,14.45 64.61,14.45 64.61,12.54 61.59,12.54
PC0
  Top 0.152: IC1.8 47.72,21.18 47.15,21.75 46.99,21.75 46.51,22.23 46.51,23.5 46.04,23.97 45.24,23.97 43.97,25.24 43.94,25.24 PH3.29
POT0
  Top 0.152: IC1.27 39.83,13.2 39.21,13.81 POT0.TP
  pour Top (isolate 0.305, no thermals): 34.45,14.76 37.54,14.76 37.54,12.86 34.45,12.86
POT1
  Top 0.152: IC1.26 39.96,13.7 37.31,16.35 POT1.TP
  pour Top (isolate 0.305, no thermals): 34.45,17.3 37.54,17.3 37.54,15.4 34.45,15.4
RC0-IN  (via drill 0.33)
  Top 0.152: 10.95,2.7 RC0.TP 10.95,3.81 v12.22,5.08 | v13.65,8.41 13.97,8.73 28.89,8.73 29.53,9.37 29.53,10 30.48,10.95 30.48,11.59 31.11,12.22 IC3.2
  Bottom 0.152: v13.65,8.41 12.22,6.99 v12.22,5.08
  pour Top (isolate 0.305, no thermals): 10,0.16 10,3.02 11.91,3.02 11.91,0.16
RC0/RX3  (via drill 0.33)
  Top 0.152: v29.37,7.78 37.78,7.78 38.89,8.89 38.89,10.95 39.64,11.7 IC1.30 44.82,11.7 46.22,10.3 IC1.38 | IC3.4 28.25,13.17 27.78,12.7 v27.78,9.84
  Bottom 0.152: v29.37,7.78 29.05,7.78 27.78,9.05 v27.78,9.84
RC1/TX3
  Top 0.152: 8.41,2.54 RC1.TP 8.41,5.24 10.48,7.3 15.08,7.3 16.19,8.41 29.69,8.41 30,8.1 37.62,8.1 38.58,9.05 38.58,11.11 39.66,12.2 IC1.29 44.8,12.2 47.22,9.78 IC1.40
  pour Top (isolate 0.305, no thermals): 7.46,0.16 7.46,3.02 9.37,3.02 9.37,0.16
RC2  (via drill 0.33)
  Top 0.152: v10.95,6.51 11.43,6.99 15.24,6.99 16.35,8.1 28.26,8.1 29.21,7.14 29.69,7.14 30,7.46 38.58,7.46 39.21,8.1 42.86,8.1 43.18,8.41 43.18,9.37 43.5,9.68 45.4,9.68 45.72,9.37 IC1.37
  Bottom 0.152: v10.95,6.51 RC2.TP
  pour Bottom (isolate 0.305, no thermals): 11.91,0.16 11.91,3.02 10,3.02 10,0.16
RPI3.3V  (via drill 0.33)
  Top 0.152: R13.2 15.1,20.64 15.24,20.64 | 15.08,20.46 C20.1
  Top 0.203: IC6.13 14.83,19.75 15.08,20 15.08,20.46 | v16.19,11.27 15.4,11.27 14.83,11.84 IC6.28 | IC6.5 18.9,15.97 v18.97,16.03
  Top 0.305: 15.1,20.64 C20.1
  Top 0.406: PH3.1 8.37,24.49 v11.75,21.11 | 15.24,20.64 v16.19,21.59
  Bottom 0.152: R12.2 17,12.05 16.99,12.22 | 21.13,15.08 R11.2 | R10.2 R9.2 26.53,18.1 25.91,18.71 IC5.8
  Bottom 0.254: C17.1 22.56,16.37 21.43,15.24 21.13,15.08
  Bottom 0.305: R11.2 19.78,15.22 v18.97,16.03 | IC5.8 23.79,18.71 22.7,17.62 C17.1
  Bottom 0.406: v11.75,21.11 15.72,21.11 | 15.72,21.11 16.99,19.84 16.99,16.03 | 16.99,16.03 16.99,12.22 16.99,12.06 v16.19,11.27 | v16.19,21.59 15.72,21.11 | v18.97,16.03 16.99,16.03
RPI5V
  Top 0.406: PH3.2 8.37,27.74 | 5.05,16.51 JP3.1
  Top 0.61: 8.37,27.74 7.3,26.67 7.3,26.11 7.06,25.88 7.06,20 | 7.06,20 7.06,17.22 6.32,16.48 JP3.1 | 5VSEL.2 7.06,20 | PH3.2 PH3.4
  Bottom 0.305: 8.41,27.78 8.41,27.73 PH3.2
  Bottom 0.406: 8.41,27.78 7.06,26.43 7.06,24.29 2.54,19.76 2.54,14.76 3.62,13.68 JP4.1
RPI-RXD
  Bottom 0.152: PH3.10 17.63,27.77 16.51,28.89 15.56,28.89 14.92,28.26 14.92,26.83 14.61,26.51 14.61,24.61 13.49,23.5 10.64,23.5 7.78,20.64 7.78,17.62 6.34,16.18 JP4.3
RPI-TXD
  Bottom 0.152: PH3.8 15.88,27.62 15.4,27.15 15.4,26.67 14.92,26.19 14.92,24.45 13.65,23.18 10.79,23.18 8.1,20.48 8.1,17.46 6.67,16.03 6.67,15.4 6.2,14.93 JP4.2
RPI_CLK  (via drill 0.33)
  Top 0.152: IC6.10 16.33,19.19 v19.05,21.91
  Bottom 0.152: v19.05,21.91 19.53,21.91 19.76,21.67 20.4,21.67 22.23,23.5 34.58,23.5 PH3.23
RPI_CS
  Top 0.152: IC6.7 18.24,16.97 18.57,17.3 18.57,18.57 22.07,22.07 24.92,22.07 26.19,23.34 31.27,23.34 32.54,24.61 32.54,25.72 33.26,26.43 34.97,26.43 PH3.24
RPI_INT
  Top 0.152: IC6.14 14.33,19.25 14.45,19.37 14.45,22.07 | 14.45,22.07 14.45,22.7 15.4,23.65 21.91,23.65 23.48,25.23 PH3.13 | R13.1 14.45,22.07
RPI_LED
  Bottom 0.152: PH3.16 26.15,27.82 25.08,28.89 20.64,28.89 19.84,28.1 19.84,27.3 19.21,26.67 17.78,26.67 17.14,26.04 17.14,24.61 16.51,23.97 15.08,23.97 13.97,22.86 10.95,22.86 8.41,20.32 8.41,17.3 7.46,16.35 7.46,11.91 8.08,11.29 R14.2
RPI_MISO  (via drill 0.33)
  Top 0.152: v20.16,22.23 19.21,21.27 18.89,21.27 16.83,19.21 IC6.9
  Bottom 0.152: PH3.21 33.77,25.2 32.38,23.81 21.75,23.81 v20.16,22.23
RPI_MOSI
  Top 0.152: IC6.8 17.94,17.47 18.26,17.78 18.26,18.73 21.91,22.38 24.77,22.38 26.04,23.65 29.65,23.65 PH3.19
RPI_SCL
  Bottom 0.152: JP4.4 6.48,17.43 7.14,18.1 7.14,20.48 10.48,23.81 13.02,23.81 13.49,24.29 13.49,25.19 PH3.5
RPI_SDA
  Bottom 0.152: JP4.5 6.32,18.7 6.83,19.21 6.83,20.64 10.95,24.77 10.95,25.19 PH3.3
RTSB  (via drill 0.33)
  Top 0.152: IC6.16 13.33,18.58 13.02,18.89 12.38,18.89 9.68,16.19 v9.68,16.03 | v9.68,13.34 9.68,12.7 8.44,11.46 JP3.5
  Bottom 0.152: v9.68,16.03 v9.68,13.34
RX1
  Top 0.152: IC1.43 48.72,8.08 47.31,6.67 43.66,6.67 43.5,6.83 39.85,6.83 39.21,6.19 31.59,6.19 30.32,4.92 26.99,4.92 26.19,4.13 RX1.TP
  pour Top (isolate 0.305, no thermals): 25.24,0.16 25.24,3.02 27.15,3.02 27.15,0.16
RX2  (via drill 0.33)
  Top 0.152: v19.37,6.03 18.57,5.24 RX2.TP | IC1.17 40.38,18.2 v40.32,18.26
  Bottom 0.152: v40.32,18.26 40.01,17.94 36.67,17.94 33.5,14.76 27.62,14.76 19.68,6.83 19.68,6.35 v19.37,6.03
  pour Top (isolate 0.305, no thermals): 17.62,0.16 17.62,3.02 19.53,3.02 19.53,0.16
RX5  (via drill 0.33)
  Top 0.152: IC6.32 17.36,13.12 17.78,12.7 17.78,11.91 19.21,10.48 24.13,10.48 25.56,11.91 25.56,16.67 27.78,18.89 PH4.2 | IC1.54 51.1,13.2 v48.1,16.19
  Bottom 0.152: v48.1,16.19 47.62,16.19 43.5,20.32 33.02,20.32 PH4.2
RXB
  Top 0.152: IC6.23 6.85,14.47 6.36,13.98 JP3.3
SCK3  (via drill 0.33)
  Top 0.152: IC4.13 55.56,15.56 v55.4,15.4 | v54.77,13.81 54.65,13.7 IC1.55 51.07,13.7 48.82,15.95 v48.82,17.3
  Bottom 0.152: v55.4,15.4 55.09,15.08 55.09,14.13 v54.77,13.81 | PH3.40 55.73,27.77 54.61,28.89 53.66,28.89 53.02,28.26 53.02,27.15 52.23,26.35 51.12,26.35 50.48,25.72 50.48,23.5 49.21,22.23 49.21,18.26 48.82,17.86 v48.82,17.3
SWCLK
  Top 0.152: IC1.49 54.23,10.7 55.72,9.21 PH1.2
SWDIO
  Top 0.152: IC1.46 50.22,7.57 50.64,7.14 51.91,7.14 PH1.4
TX1
  Top 0.152: IC1.42 48.22,8.05 47.15,6.99 43.81,6.99 43.66,7.14 39.69,7.14 39.05,6.51 31.43,6.51 30.16,5.24 26.83,5.24 25.24,3.65 24.13,3.65 23.65,3.17 TX1.TP
  pour Top (isolate 0.305, no thermals): 24.61,3.02 24.61,0.16 22.7,0.16 22.7,3.02
TX2  (via drill 0.33)
  Top 0.152: IC1.16 43.72,18.48 v43.5,18.26 | v17.3,5.08 16.03,3.81 TX2.TP
  Bottom 0.152: v43.5,18.26 42.86,17.62 36.83,17.62 33.66,14.45 27.78,14.45 20,6.67 20,5.87 19.21,5.08 v17.3,5.08
  pour Top (isolate 0.305, no thermals): 15.08,0.16 15.08,3.02 16.99,3.02 16.99,0.16
TX5  (via drill 0.33)
  Top 0.152: PH4.3 29.84,21.43 25.24,16.83 25.24,12.06 23.97,10.79 19.37,10.79 18.1,12.06 18.1,13.55 IC6.1 | IC1.53 51.12,12.7 48.26,15.56 47.94,15.56 47.47,16.03 v47.47,17.14
  Bottom 0.152: v47.47,17.14 47.15,17.14 43.66,20.64 32.07,20.64 PH4.3
TXB
  Top 0.152: IC6.22 6.92,14.97 6.66,15.23 JP3.2
VCC  (via drill 0.33)
  Top 0.152: VBAT.TP 34.45,3.02 | PH2.1 63.5,8.41 | 47.47,6.03 47.47,6.19 48.74,7.46 v49.05,7.46 | C16.1 59.75,7.88 59.85,7.62
  Top 0.406: 51.16,3.37 51.12,3.33
  Top 0.61: JP1.1 51.16,3.37
  Top 0.813: 34.45,3.02 34.45,3.33 36.35,5.24 39.21,5.24 40.16,6.19 43.18,6.19 43.34,6.03 47.47,6.03 50.32,3.33 51.12,3.33 52.39,2.06 55.4,2.06 57.47,4.13 57.47,5.24 59.85,7.62 60.64,8.41 PH2.1
  Bottom 0.152: v49.05,7.46 49.05,9.53 48.74,9.84 R7.1
  pour Top (isolate 0.305, no thermals): 33.5,3.33 35.4,3.33 35.4,0.16 33.5,0.16
  pour Top (isolate 0.305, no thermals): 61.59,9.37 64.61,9.37 64.61,7.46 61.59,7.46
XOR  (via drill 0.33)
  Top 0.152: IC1.41 47.72,8.03 47.31,7.62 v46.83,7.62 | v35.24,8.73 34.92,8.73 34.61,8.41 30.48,8.41 30.16,8.73 30.16,9.51 R6.2 30.16,9.54 30.16,10.16 31.12,11.12 IC3.1
  Bottom 0.152: v46.83,7.62 46.83,7.94 46.04,8.73 43.81,8.73 42.7,7.62 36.35,7.62 v35.24,8.73

### Text on the board
tNames: Pi5V-5V | C8 | R13 | ttySC0 | Uart | C12 | C3 | NTX | tty / SC1 | Tx | 3.3V | C11 | Q1 | C20 | WP | GND | Rx | BUT | C1 | G | C19 | Pi5V | G | P1 | Tx | Rx | Q2 | IC1 | IC2 | Rx | P0 | Tx | CTS | IC6 | (c) OlliW | C2 | RTS | C18 | IC3 | G | 5V | GND | STorM32 RPiHat | SWD | C16 | R6 | Led3 | v3.3i | rev 006 | C9 | + | - | VB | G | 5V | Tx | Rx | G | VBAT | R3 | NTX | 5V | RC1 | RC0 | G | Tx2 | Rx2 | G | Tx1 | Rx1 | G | R2 | G | R
bNames: IC5 | (c) www.olliw.eu | GND | NTX | GND | R1 | BL | SDA | SCL | R9 | R10 | Rx | RXD | C13 | R4 | R8 | R7 | C10 | TXD | R12 | R11 | C17 | C7 | R5 | Tx | Pi5V | C4 | IC2 | C5 | C6 | 5V | VBAT | Pi / Uart / I2C | SWD | GND | Rx | Tx | 5V | NT | 3.3V | RC2 | G | 5V | EG | ER | A1 | A0 | G | C15 | C14